# Altium schematic sheet cjb.SchDoc
size A4; SheetNumber: 1; SheetTotal: 2
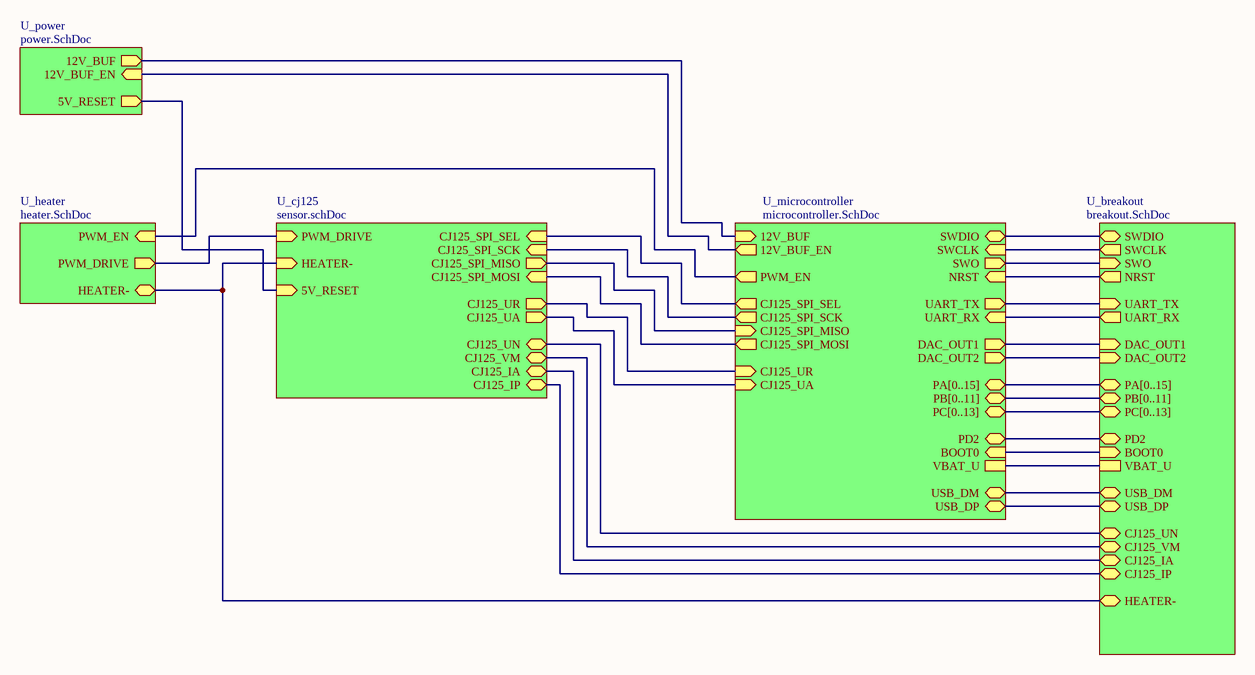
[diagram p0: cjb.SchDoc]

## Sub-sheets
U_breakout = breakout.SchDoc: SWDIO (bidir), SWCLK (out), SWO (in), NRST (out), DAC_OUT1 (in), DAC_OUT2 (in), UART_TX (in), UART_RX (out), PD2 (bidir), BOOT0 (in), VBAT_U, PA[0..15] (bidir), PC[0..13] (bidir), HEATER- (bidir), CJ125_IP (bidir), CJ125_IA (bidir), CJ125_VM (bidir), CJ125_UN (bidir), PB[0..11] (bidir), USB_DM (bidir), USB_DP (bidir)
U_cj125 = sensor.schDoc: CJ125_SPI_SCK (in), CJ125_SPI_MISO (out), CJ125_SPI_MOSI (in), CJ125_SPI_SEL (in), CJ125_IP (bidir), CJ125_UA (out), CJ125_UN (bidir), CJ125_IA (bidir), CJ125_VM (bidir), CJ125_UR (out), HEATER- (in), PWM_DRIVE (in), 5V_RESET (in)
U_heater = heater.SchDoc: HEATER- (bidir), PWM_DRIVE (out), PWM_EN (in)
U_microcontroller = microcontroller.SchDoc: SWDIO (bidir), SWCLK (in), SWO (out), NRST (in), DAC_OUT1 (out), DAC_OUT2 (out), UART_TX (out), UART_RX (in), CJ125_SPI_SCK (out), CJ125_SPI_MISO (in), CJ125_SPI_MOSI (out), PD2 (bidir), BOOT0 (in), VBAT_U, CJ125_SPI_SEL (out), PA[0..15] (bidir), PC[0..13] (bidir), CJ125_UA (in), CJ125_UR (in), PB[0..11] (bidir), 12V_BUF_EN (out), 12V_BUF (in), PWM_EN (out), USB_DM (bidir), USB_DP (bidir)
U_power = power.SchDoc: 5V_RESET (out), 12V_BUF_EN (in), 12V_BUF (out)

## Nets
(unnamed): sheet U_power/5V_RESET, sheet U_cj125/5V_RESET
(unnamed): sheet U_power/12V_BUF_EN, sheet U_microcontroller/12V_BUF_EN
(unnamed): sheet U_power/12V_BUF, sheet U_microcontroller/12V_BUF
(unnamed): sheet U_microcontroller/SWDIO, sheet U_breakout/SWDIO
(unnamed): sheet U_microcontroller/SWCLK, sheet U_breakout/SWCLK
(unnamed): sheet U_microcontroller/SWO, sheet U_breakout/SWO
(unnamed): sheet U_microcontroller/NRST, sheet U_breakout/NRST
(unnamed): sheet U_microcontroller/DAC_OUT1, sheet U_breakout/DAC_OUT1
(unnamed): sheet U_microcontroller/DAC_OUT2, sheet U_breakout/DAC_OUT2
(unnamed): sheet U_microcontroller/UART_TX, sheet U_breakout/UART_TX
(unnamed): sheet U_microcontroller/UART_RX, sheet U_breakout/UART_RX
(unnamed): sheet U_microcontroller/CJ125_SPI_SCK, sheet U_cj125/CJ125_SPI_SCK
(unnamed): sheet U_microcontroller/CJ125_SPI_MISO, sheet U_cj125/CJ125_SPI_MISO
(unnamed): sheet U_microcontroller/CJ125_SPI_MOSI, sheet U_cj125/CJ125_SPI_MOSI
(unnamed): sheet U_microcontroller/PD2, sheet U_breakout/PD2
(unnamed): sheet U_microcontroller/BOOT0, sheet U_breakout/BOOT0
(unnamed): sheet U_microcontroller/VBAT_U, sheet U_breakout/VBAT_U
(unnamed): sheet U_microcontroller/CJ125_SPI_SEL, sheet U_cj125/CJ125_SPI_SEL
(unnamed): sheet U_microcontroller/CJ125_UA, sheet U_cj125/CJ125_UA
(unnamed): sheet U_microcontroller/CJ125_UR, sheet U_cj125/CJ125_UR
(unnamed): sheet U_microcontroller/PWM_EN, sheet U_heater/PWM_EN
(unnamed): sheet U_microcontroller/USB_DM, sheet U_breakout/USB_DM
(unnamed): sheet U_microcontroller/USB_DP, sheet U_breakout/USB_DP
(unnamed): sheet U_breakout/HEATER-, sheet U_cj125/HEATER-, sheet U_heater/HEATER-
(unnamed): sheet U_breakout/CJ125_IP, sheet U_cj125/CJ125_IP
(unnamed): sheet U_breakout/CJ125_IA, sheet U_cj125/CJ125_IA
(unnamed): sheet U_breakout/CJ125_VM, sheet U_cj125/CJ125_VM
(unnamed): sheet U_breakout/CJ125_UN, sheet U_cj125/CJ125_UN
(unnamed): sheet U_cj125/PWM_DRIVE, sheet U_heater/PWM_DRIVE

## Buses and harness runs
bus sheet U_breakout/PA[0..15] = sheet U_microcontroller/PA[0..15]
bus sheet U_breakout/PB[0..11] = sheet U_microcontroller/PB[0..11]
bus sheet U_breakout/PC[0..13] = sheet U_microcontroller/PC[0..13]

## Notes on the sheet
- Title
- Title:
- Project:
- Size:
- Date:
- File:
- E
- Number:
- Time:
- Revision:
- Sheet
- of